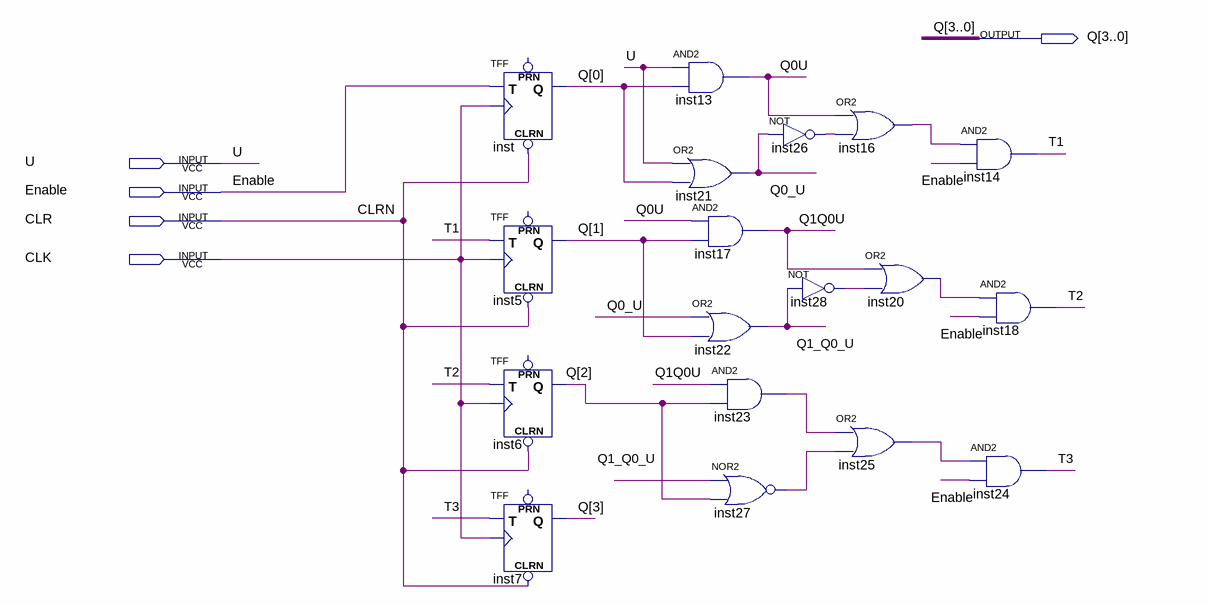
[diagram p0: schematic sheet]
// Quartus schematic UDCounter.bdf as structural Verilog: 18 symbols, 5 pins
module UDCounter (
  input  U,
  input  Enable,
  input  CLR,
  input  CLK,
  output [3:0] Q
);

  wire inst16_out, inst20_out, inst23_out, inst25_out, inst26_out, inst27_out, inst28_out, Q0_U, Q0U,
       Q1_Q0_U, Q1Q0U, T1, T2, T3;

  TFF inst (.CLRN(CLR), .T(Enable), .CLK(CLK), .Q(Q[0]));  // open: PRN
  TFF inst5 (.CLRN(CLR), .T(T1), .CLK(CLK), .Q(Q[1]));  // open: PRN
  TFF inst6 (.CLRN(CLR), .T(T2), .CLK(CLK), .Q(Q[2]));  // open: PRN
  TFF inst7 (.CLRN(CLR), .T(T3), .CLK(CLK), .Q(Q[3]));  // open: PRN
  and inst13 (Q0U, U, Q[0]);
  or inst21 (Q0_U, U, Q[0]);
  and inst17 (Q1Q0U, Q0U, Q[1]);
  or inst22 (Q1_Q0_U, Q0_U, Q[1]);
  and inst23 (inst23_out, Q1Q0U, Q[2]);
  nor inst27 (inst27_out, Q1_Q0_U, Q[2]);
  not inst26 (inst26_out, Q0_U);
  not inst28 (inst28_out, Q1_Q0_U);
  or inst16 (inst16_out, Q0U, inst26_out);
  or inst20 (inst20_out, Q1Q0U, inst28_out);
  or inst25 (inst25_out, inst23_out, inst27_out);
  and inst14 (T1, inst16_out, Enable);
  and inst18 (T2, inst20_out, Enable);
  and inst24 (T3, inst25_out, Enable);

  // Other names for the same wires on the sheet: CLRN = CLR
endmodule
